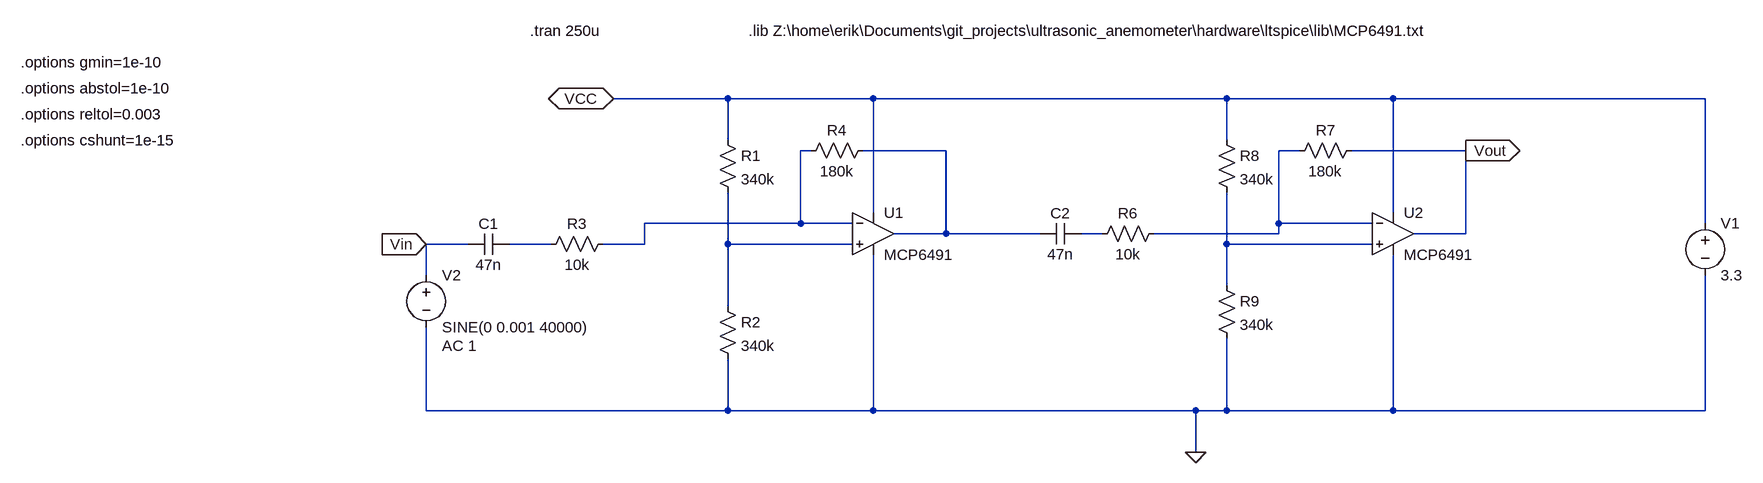
[diagram p0: schematic ultrasonic_amplifier.asc]
ultrasonic_amplifier.asc, the LTspice schematic file:
Version 4
SHEET 1 1696 836
WIRE 128 272 -48 272
WIRE 352 272 128 272
WIRE 896 272 352 272
WIRE 1152 272 896 272
WIRE 1632 272 1152 272
WIRE 128 336 128 272
WIRE 896 336 896 272
WIRE 256 352 240 352
WIRE 464 352 336 352
WIRE 1008 352 976 352
WIRE 1264 352 1088 352
WIRE 352 448 352 272
WIRE 1152 448 1152 272
WIRE 240 464 240 352
WIRE 240 464 0 464
WIRE 320 464 240 464
WIRE 976 464 976 352
WIRE 1120 464 976 464
WIRE 1632 464 1632 272
WIRE 464 480 464 352
WIRE 464 480 384 480
WIRE 608 480 464 480
WIRE 704 480 672 480
WIRE 976 480 976 464
WIRE 976 480 784 480
WIRE 1264 480 1264 352
WIRE 1264 480 1184 480
WIRE -272 496 -336 496
WIRE -144 496 -208 496
WIRE 0 496 0 464
WIRE 0 496 -64 496
WIRE 128 496 128 416
WIRE 320 496 128 496
WIRE 896 496 896 416
WIRE 1120 496 896 496
WIRE -336 544 -336 496
WIRE 896 560 896 496
WIRE 128 592 128 496
WIRE -336 752 -336 624
WIRE 128 752 128 672
WIRE 128 752 -336 752
WIRE 352 752 352 512
WIRE 352 752 128 752
WIRE 848 752 352 752
WIRE 896 752 896 640
WIRE 896 752 848 752
WIRE 1152 752 1152 512
WIRE 1152 752 896 752
WIRE 1632 752 1632 544
WIRE 1632 752 1152 752
WIRE 848 816 848 752
FLAG 848 816 0
FLAG -48 272 VCC
IOPIN -48 272 BiDir
FLAG -336 496 Vin
IOPIN -336 496 In
FLAG 1264 352 Vout
IOPIN 1264 352 Out
SYMBOL Opamps\\opamp2 352 416 R0
SYMATTR InstName U1
SYMATTR Value MCP6491
SYMATTR SpiceModel MCP6491
SYMBOL voltage 1632 448 R0
WINDOW 123 0 0 Left 2
WINDOW 39 0 0 Left 2
SYMATTR InstName V1
SYMATTR Value 3.3
SYMBOL voltage -336 528 R0
WINDOW 123 24 124 Left 2
WINDOW 39 0 0 Left 2
SYMATTR Value2 AC 1
SYMATTR InstName V2
SYMATTR Value SINE(0 0.001 40000)
SYMBOL cap -208 480 R90
WINDOW 0 0 32 VBottom 2
WINDOW 3 32 32 VTop 2
SYMATTR InstName C1
SYMATTR Value 47n
SYMBOL res 112 320 R0
SYMATTR InstName R1
SYMATTR Value 340k
SYMBOL res 112 576 R0
SYMATTR InstName R2
SYMATTR Value 340k
SYMBOL res 352 336 R90
WINDOW 0 0 56 VBottom 2
WINDOW 3 32 56 VTop 2
SYMATTR InstName R4
SYMATTR Value 180k
SYMBOL res -48 480 R90
WINDOW 0 0 56 VBottom 2
WINDOW 3 32 56 VTop 2
SYMATTR InstName R3
SYMATTR Value 10k
SYMBOL res 800 464 R90
WINDOW 0 0 56 VBottom 2
WINDOW 3 32 56 VTop 2
SYMATTR InstName R6
SYMATTR Value 10k
SYMBOL res 1104 336 R90
WINDOW 0 0 56 VBottom 2
WINDOW 3 32 56 VTop 2
SYMATTR InstName R7
SYMATTR Value 180k
SYMBOL Opamps\\opamp2 1152 416 R0
SYMATTR InstName U2
SYMATTR Value MCP6491
SYMATTR SpiceModel MCP6491
SYMBOL cap 672 464 R90
WINDOW 0 0 32 VBottom 2
WINDOW 3 32 32 VTop 2
SYMATTR InstName C2
SYMATTR Value 47n
SYMBOL res 880 320 R0
SYMATTR InstName R8
SYMATTR Value 340k
SYMBOL res 880 544 R0
SYMATTR InstName R9
SYMATTR Value 340k
TEXT 160 168 Left 2 !.lib Z:\\home\\erik\\Documents\\git_projects\\ultrasonic_anemometer\\hardware\\ltspice\\lib\\MCP6491.txt
TEXT -176 168 Left 2 !.tran 250u
TEXT -960 216 Left 2 !.options gmin=1e-10
TEXT -960 256 Left 2 !.options abstol=1e-10
TEXT -960 296 Left 2 !.options reltol=0.003
TEXT -960 336 Left 2 !.options cshunt=1e-15

The netlist it stands for:
* ultrasonic_amplifier.asc
XU1 N006 N001 VCC 0 N002 MCP6491 MCP6491  ; pins In+ In- V+ V- OUT
V1 VCC 0 3.3
V2 Vin 0 SINE(0 0.001 40000) AC 1
C1 N005 Vin 47n
R1 VCC N006 340k
R2 N006 0 340k
R4 N002 N001 180k
R3 N001 N005 10k
R6 N003 N004 10k
R7 Vout N003 180k
XU2 N007 N003 VCC 0 Vout MCP6491 MCP6491  ; pins In+ In- V+ V- OUT
C2 N004 N002 47n
R8 VCC N007 340k
R9 N007 0 340k
.lib Z:\home\erik\Documents\git_projects\ultrasonic_anemometer\hardware\ltspice\lib\MCP6491.txt
.tran 250u
.options gmin=1e-10
.options abstol=1e-10
.options reltol=0.003
.options cshunt=1e-15
.backanno
.end